# EAGLE design project_simonsays (EAGLE 9.6.2)
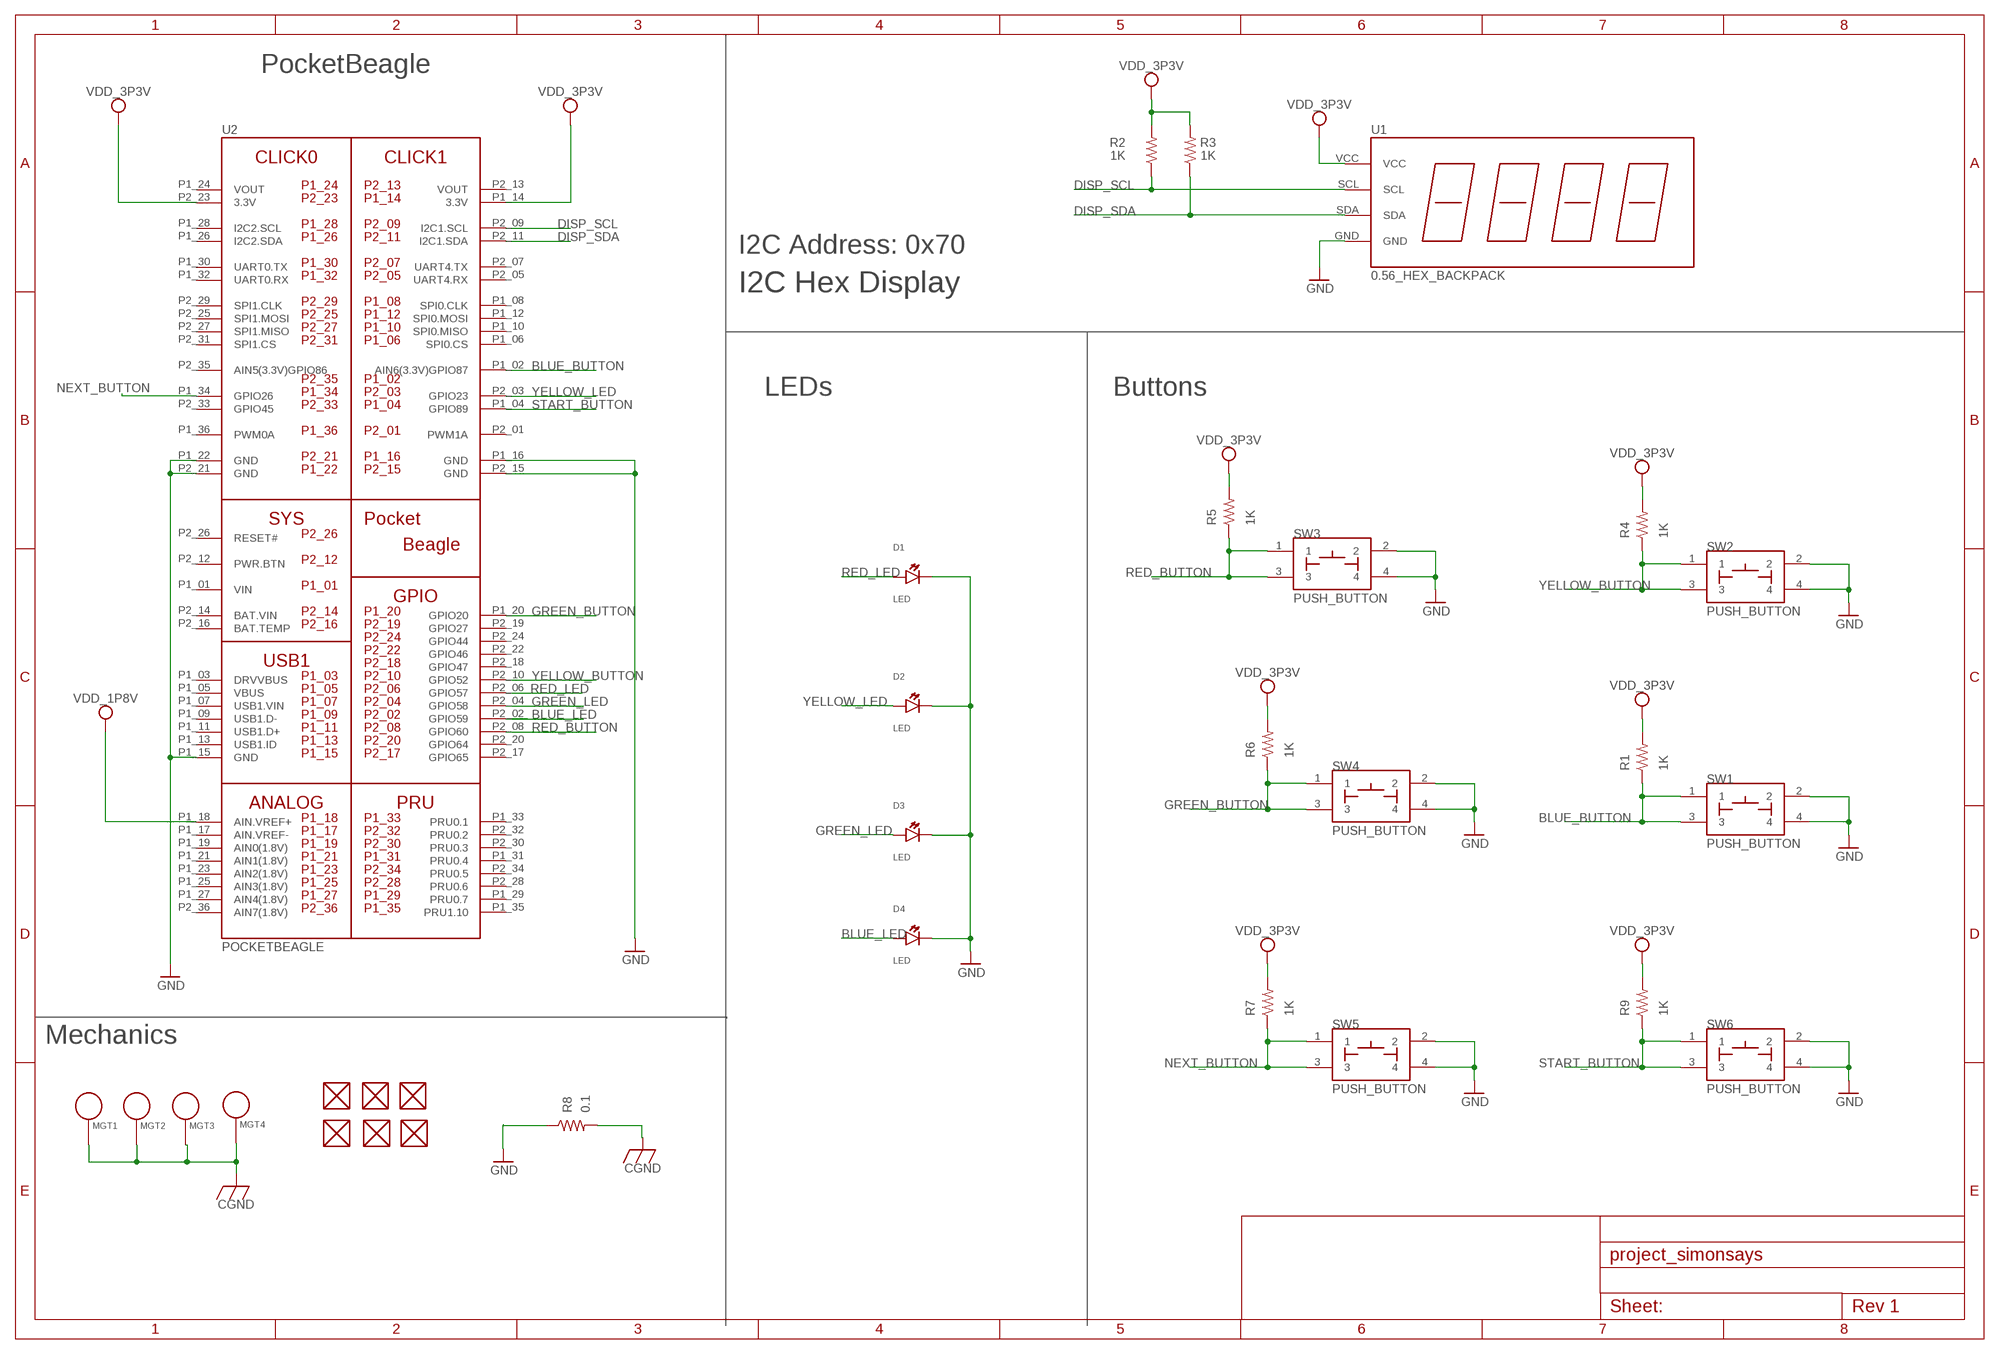
[diagram p0: schematic, sheet 1]

## Parts
D1  LED  [EIA-STD]
D2  LED  [EIA-STD]
D3  LED  [EIA-STD]
D4  LED  [EIA-STD]
FUD1  FIDUCIAL  [FIDUCIAL_40MIL]
FUD2  FIDUCIAL  [FIDUCIAL_40MIL]
FUD3  FIDUCIAL  [FIDUCIAL_40MIL]
FUD4  FIDUCIAL  [FIDUCIAL_40MIL]
FUD5  FIDUCIAL  [FIDUCIAL_40MIL]
FUD6  FIDUCIAL  [FIDUCIAL_40MIL]
MGT1  MOUNTING_HOLE  [MOUNTING_HOLE]
MGT2  MOUNTING_HOLE  [MOUNTING_HOLE]
MGT3  MOUNTING_HOLE  [MOUNTING_HOLE]
MGT4  MOUNTING_HOLE  [MOUNTING_HOLE]
R1  1K  R_R0603  [R0603]
R2  1K  R_R0603  [R0603]
R3  1K  R_R0603  [R0603]
R4  1K  R_R0603  [R0603]
R5  1K  R_R0603  [R0603]
R6  1K  R_R0603  [R0603]
R7  1K  R_R0603  [R0603]
R8  0.1  R_R0805  [R0805]
R9  1K  R_R0603  [R0603]
SW1  PUSH_BUTTON  [BUTTON_12.5MM]
SW2  PUSH_BUTTON  [BUTTON_12.5MM]
SW3  PUSH_BUTTON  [BUTTON_12.5MM]
SW4  PUSH_BUTTON  [BUTTON_12.5MM]
SW5  PUSH_BUTTON  [BUTTON_12.5MM]
SW6  PUSH_BUTTON  [BUTTON_12.5MM]
U1  0.56_HEX_BACKPACK  [0.56_HEX_BACKPACK]
U2  POCKETBEAGLE  [POCKETBEAGLE]

## Nets
BLUE_BUTTON: R1.1 SW1.1 SW1.3 U2.P1_02(AIN6(3.3V)GPIO87)
BLUE_LED: D4.ANODE U2.P2_02(GPIO59)
CGND: MGT1.P$1 MGT2.P$1 MGT3.P$1 MGT4.P$1 R8.2
DISP_SCL: R2.1 U1.SCL U2.P2_09(I2C1.SCL)
DISP_SDA: R3.1 U1.SDA U2.P2_11(I2C1.SDA)
GND: D1.CATHODE D2.CATHODE D3.CATHODE D4.CATHODE R8.1 SW1.2 SW1.4 SW2.2 SW2.4 SW3.2 SW3.4 SW4.2 SW4.4 SW5.2 SW5.4 SW6.2 SW6.4 U1.GND U2.P1_15(GND) U2.P1_16(GND) U2.P1_22(GND) U2.P2_15(GND) U2.P2_21(GND)
GREEN_BUTTON: R6.1 SW4.1 SW4.3 U2.P1_20(GPIO20)
GREEN_LED: D3.ANODE U2.P2_04(GPIO58)
NEXT_BUTTON: R7.1 SW5.1 SW5.3 U2.P1_34(GPIO26)
RED_BUTTON: R5.1 SW3.1 SW3.3 U2.P2_08(GPIO60)
RED_LED: D1.ANODE U2.P2_06(GPIO57)
START_BUTTON: R9.1 SW6.1 SW6.3 U2.P1_04(GPIO89)
VDD_1P8V: U2.P1_18(AIN.VREF+)
VDD_3P3V: R1.2 R2.2 R3.2 R4.2 R5.2 R6.2 R7.2 R9.2 U1.VCC U2.P1_14(3.3V) U2.P2_23(3.3V)
YELLOW_BUTTON: R4.1 SW2.1 SW2.3 U2.P2_10(GPIO52)
YELLOW_LED: D2.ANODE U2.P2_03(GPIO23)
Unconnected: FUD1.P$1 FUD2.P$1 FUD3.P$1 FUD4.P$1 FUD5.P$1 FUD6.P$1 U2.P1_03(DRVVBUS) U2.P1_05(VBUS) U2.P1_06(SPI0.CS) U2.P1_07(USB1.VIN) U2.P1_08(SPI0.CLK) U2.P1_09(USB1.D-) U2.P1_10(SPI0.MISO) U2.P1_11(USB1.D+) U2.P1_12(SPI0.MOSI) U2.P1_13(USB1.ID) U2.P1_17(AIN.VREF-) U2.P1_19(AIN0(1.8V)) U2.P1_21(AIN1(1.8V)) U2.P1_23(AIN2(1.8V)) U2.P1_25(AIN3(1.8V)) U2.P1_26(I2C2.SDA) U2.P1_27(AIN4(1.8V)) U2.P1_28(I2C2.SCL) U2.P1_29(PRU0.7) U2.P1_30(UART0.TX) U2.P1_31(PRU0.4) U2.P1_32(UART0.RX) U2.P1_33(PRU0.1) U2.P1_35(PRU1.10) U2.P1_36(PWM0A) U2.P2_01(PWM1A) U2.P2_05(UART4.RX) U2.P2_07(UART4.TX) U2.P2_12(PWR.BTN) U2.P2_16(BAT.TEMP) U2.P2_17(GPIO65) U2.P2_18(GPIO47) U2.P2_19(GPIO27) U2.P2_20(GPIO64) U2.P2_22(GPIO46) U2.P2_24(GPIO44) U2.P2_25(SPI1.MOSI) U2.P2_26(RESET#) U2.P2_27(SPI1.MISO) U2.P2_28(PRU0.6) U2.P2_29(SPI1.CLK) U2.P2_30(PRU0.3) U2.P2_31(SPI1.CS) U2.P2_32(PRU0.2) U2.P2_33(GPIO45) U2.P2_34(PRU0.5) U2.P2_35(AIN5(3.3V)GPIO86) U2.P2_36(AIN7(1.8V))

## Notes on the sheet
- PocketBeagle
- I2C Address: 0x70
- I2C Hex Display
- LEDs | Buttons
- Mechanics

## Power pins joined to a net without a drawn wire
BAT.VIN: U2.P2_14(BAT.VIN)
VIN: U2.P1_01(VIN)
VOUT: U2.P1_24(VOUT) U2.P2_13(VOUT)

## Library data of the parts
D1-D4 = project_simonsays:LED: EIA-STD LED, LTST-C191TBKT
FUD1-FUD6 = combo_lock:FIDUCIAL
MGT1-MGT4 = combo_lock:MOUNTING_HOLE: Chassis Mounting Hole w/GND connection ability
R1-R7 R9 = project_simonsays:R_: RESISTOR, American symbol
R8 = combo_lock:R_: RESISTOR, American symbol
SW1-SW6 = project_simonsays:PUSH_BUTTON
U1 = project_simonsays:0.56_HEX_BACKPACK: 0.56" LED HEX Backback - Adafruit HT16K33 - https://www.adafruit.com/product/878 - https://www.adafruit.com/product/879 - https://www.adafruit.com/product/880 - https://www.adafruit.com/product/881 - https://www.adafruit.com/product/1002
U2 = project_simonsays:POCKETBEAGLE

## Board
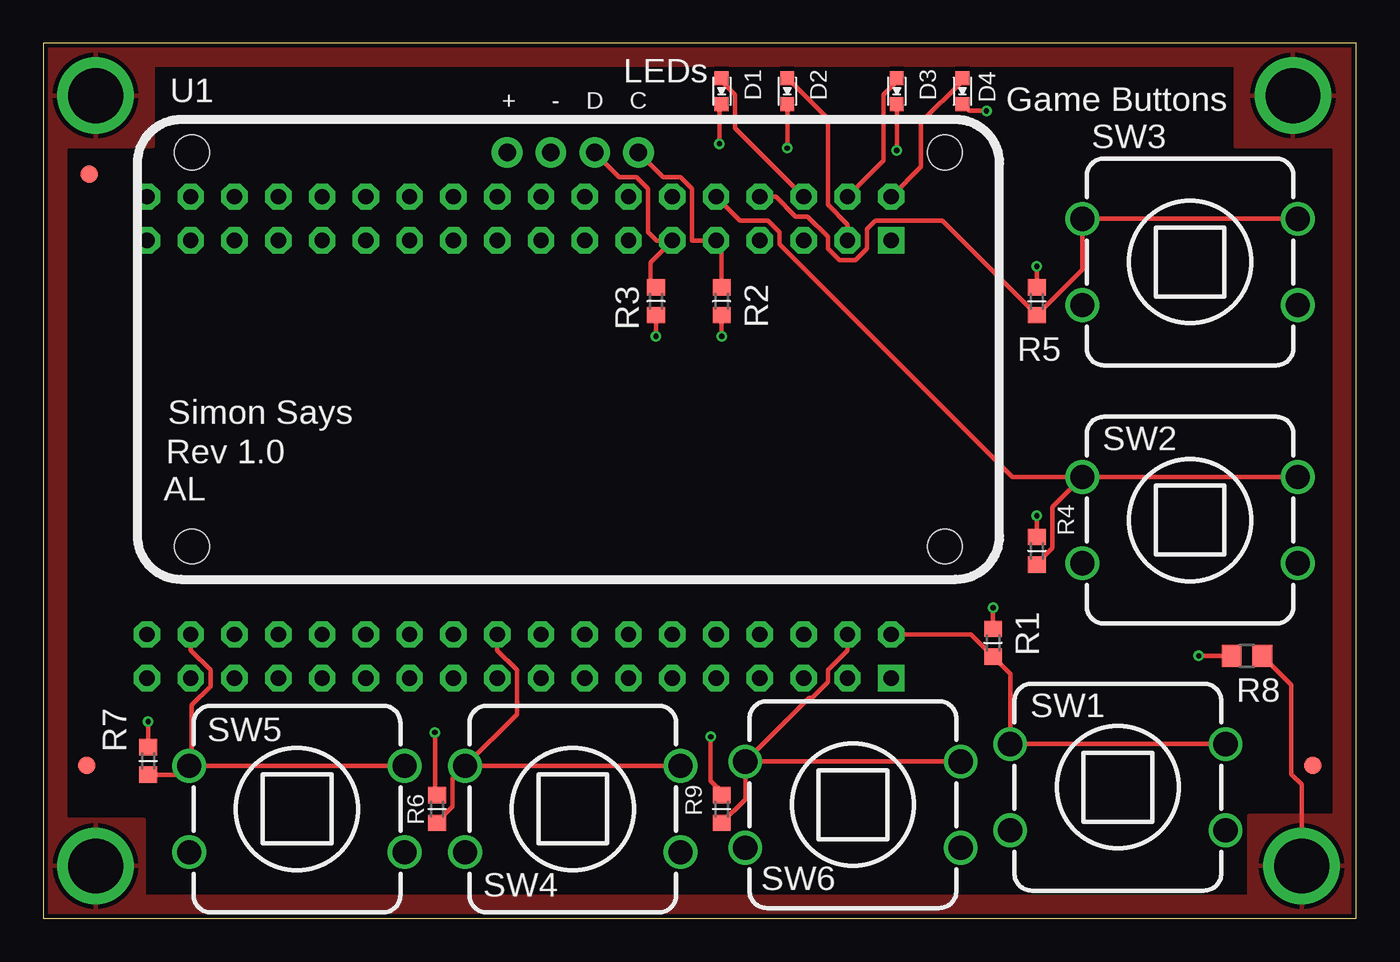
[diagram p1: board, top side]
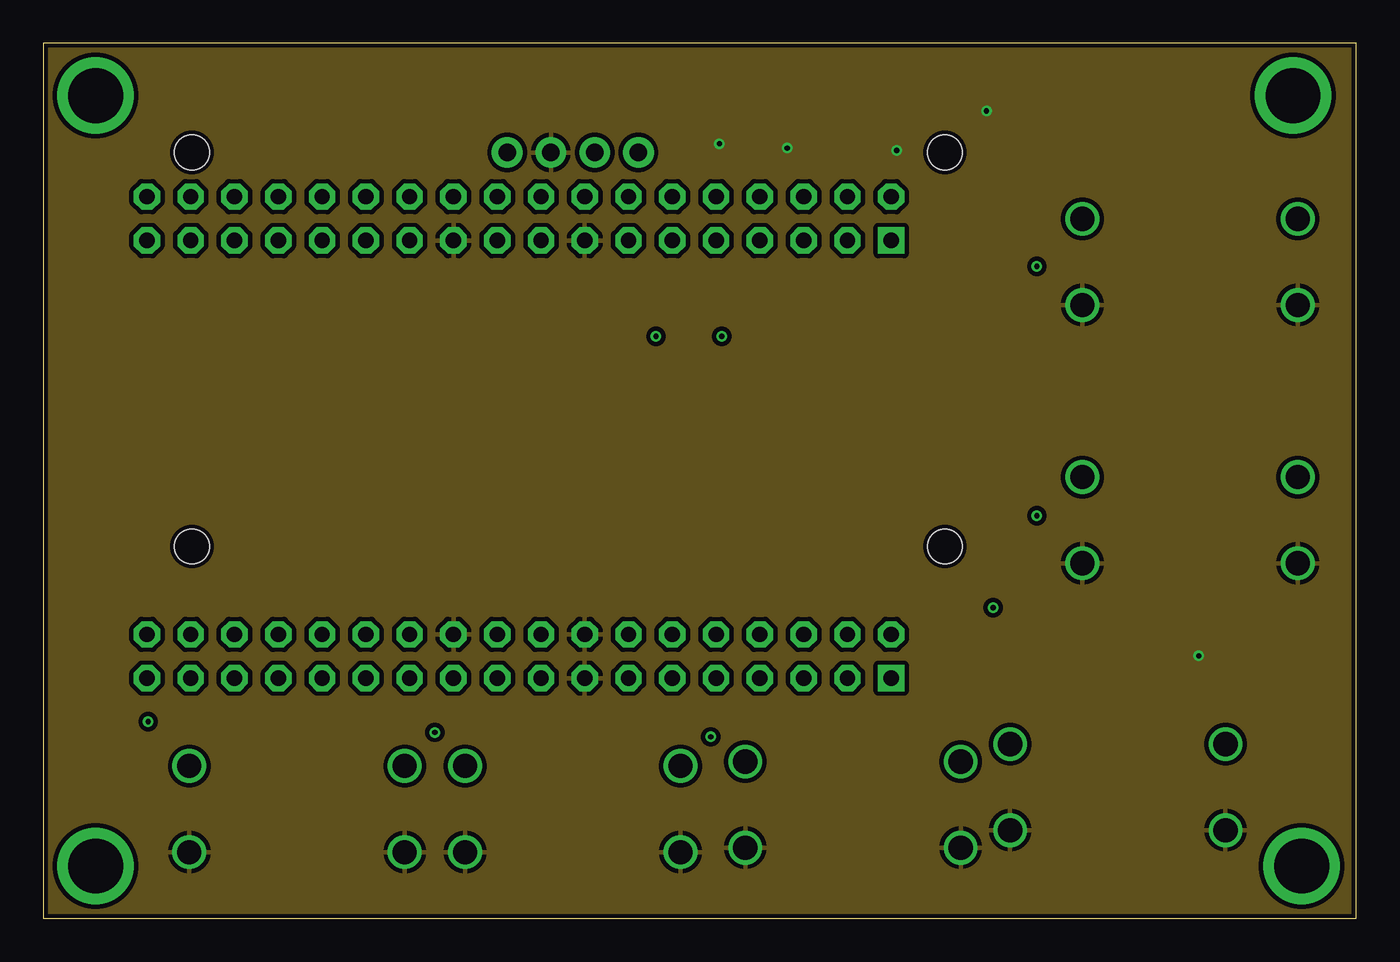
[diagram p2: board, inner layer Route2]
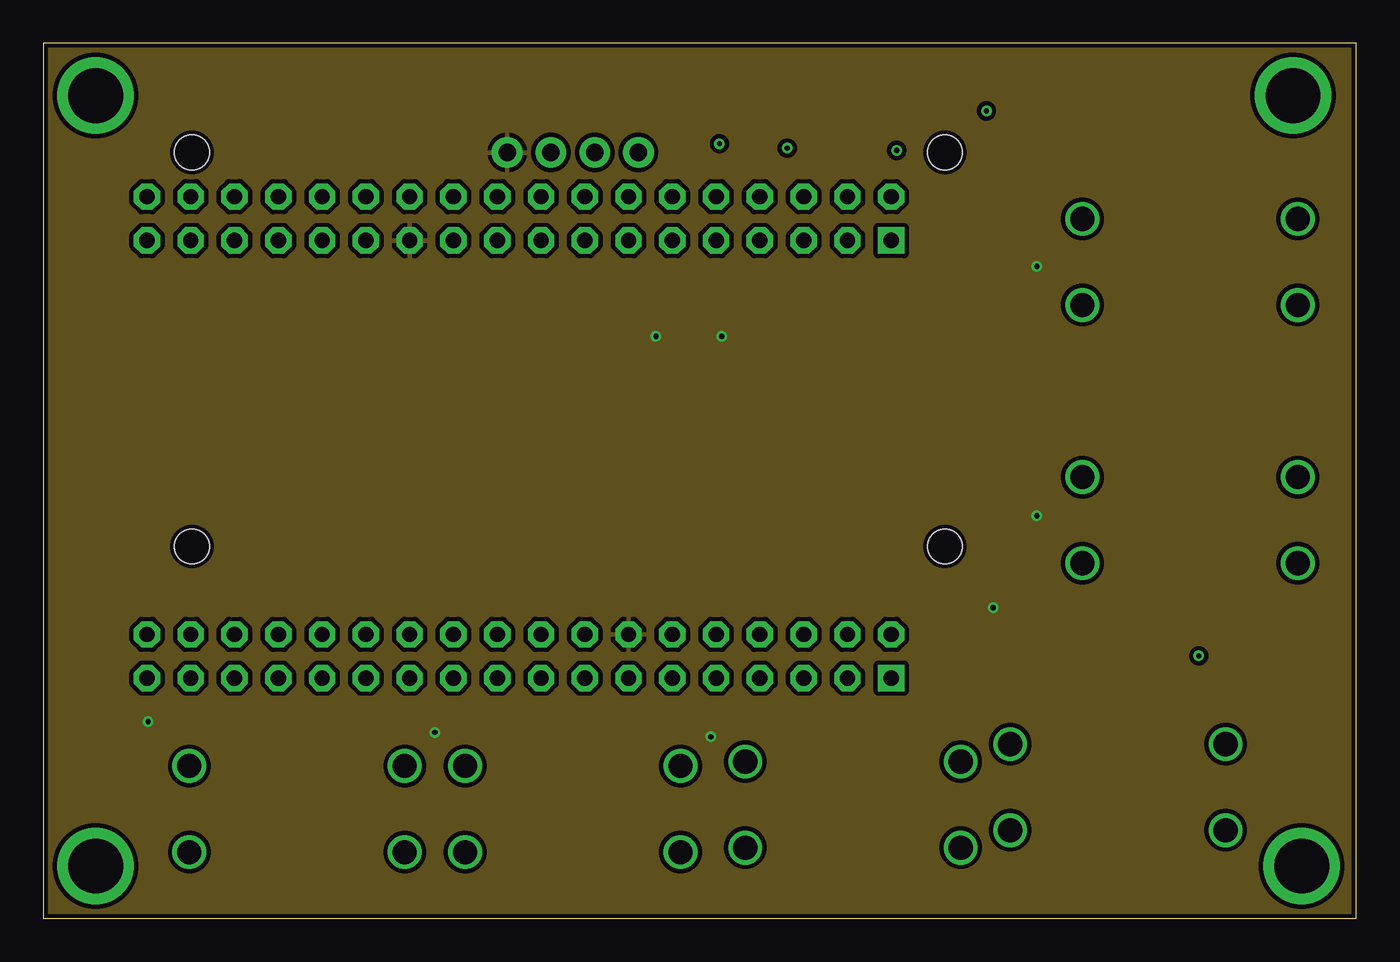
[diagram p3: board, inner layer Route15]
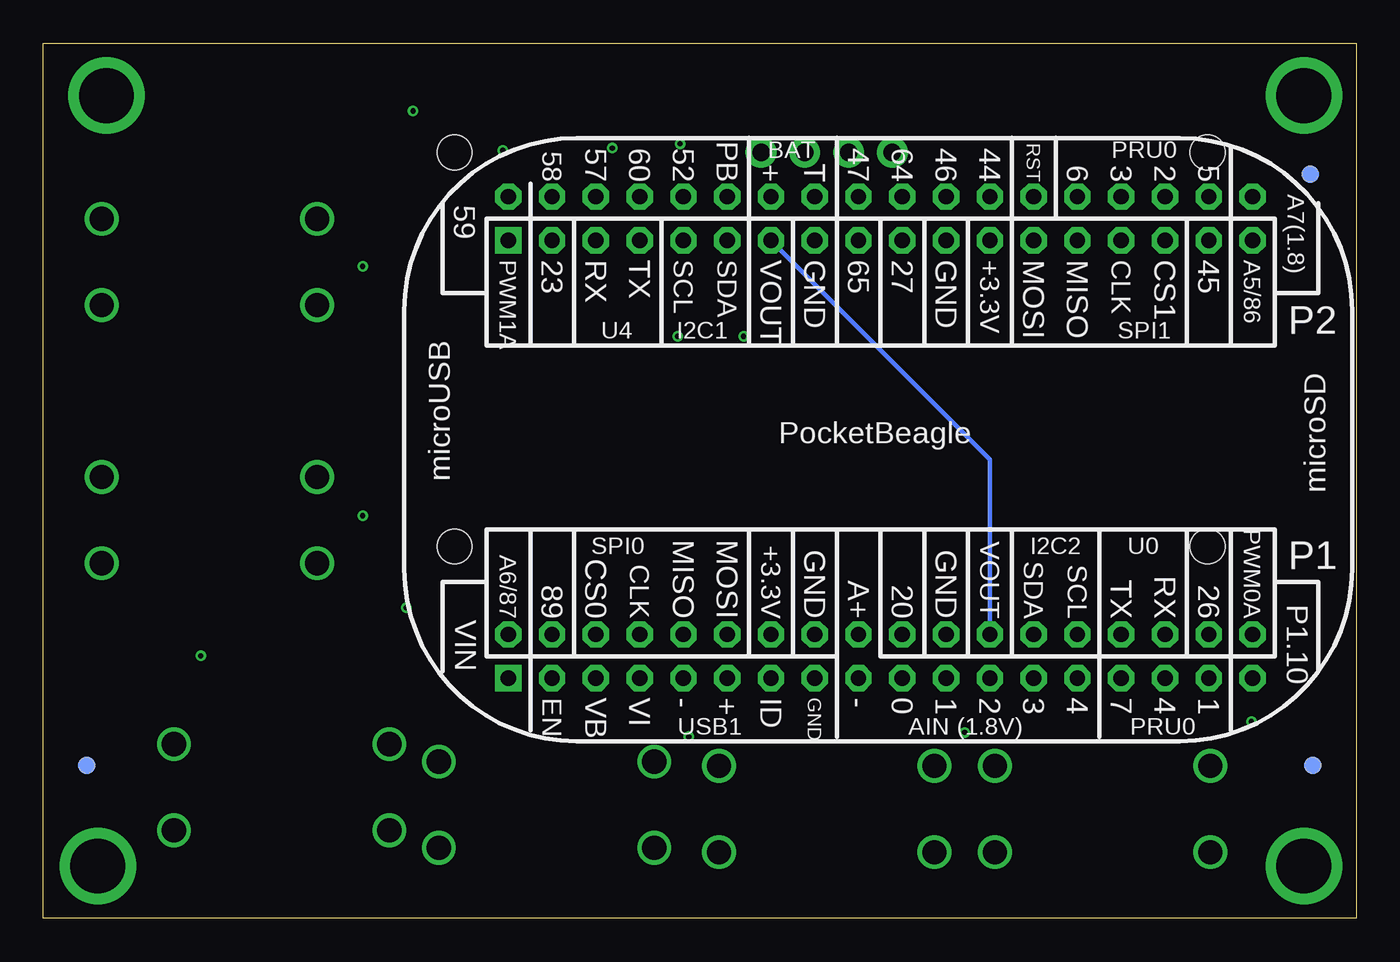
[diagram p4: board, bottom side, seen from below]

Size 76.2 x 50.8 mm. Coordinates in mm from the lower left corner, seen from the top.
Outline: 0,0 76.2,0 76.2,50.8 0,50.8 0,0
Copper layers (1*2*15*16): Top 0.035mm / dielectric 0.23mm / Route2 0.035mm / dielectric 0.93mm / Route15 0.035mm / dielectric 0.23mm / Bottom 0.035mm
Design rules "ENGI301_4lyr": minimum track width 10mil, minimum drill 12mil, track to track 10mil, track to pad 10mil, pad to pad 10mil, via to via 10mil, smd to smd 10mil, copper to edge 10mil, drill to drill 12mil, minimum pad ring 6mil, minimum via ring 6mil, stop-mask expansion 3mil, vias tented up to drill 25mil, thermal gap 10mil

### Footprints (pad centres in the part's own frame; a part is rotated, then mirrored left to right if it is on the bottom)
EIA-STD = smd 0.8 x 0.8: ANODE -0.75,0; CATHODE 0.75,0
FIDUCIAL_40MIL = smd 1.016 x 1.016: P$1 0,0
MOUNTING_HOLE = drill 3.175 pad 4.445: P$1 0,0
R0603 = smd 0.95 x 1.031: 1 -0.8,0; 2 0.8,0
R0805 = smd 1.143 x 1.27: 1 -0.889,0; 2 0.889,0
BUTTON_12.5MM = drill 1.4: 1 -6.25,2.5; 2 -6.25,-2.5; 3 6.25,2.5; 4 6.25,-2.5
0.56_HEX_BACKPACK = drill 1.016 pad 1.778: GND -1.016,11.43; SCL 4.064,11.43; SDA 1.524,11.43; VCC -3.556,11.43 | hole 2: -21.844,-11.43; 21.844,-11.43; -21.844,11.43; 21.844,11.43
POCKETBEAGLE = drill 0.889 pad 1.524 square: P1_01 5.91,3.53; P2_01 5.91,28.93 | drill 0.889 pad 1.524 octagon: P1_02 5.91,6.07; P1_03 8.45,3.53; P1_04 8.45,6.07; P1_05 10.99,3.53; P1_06 10.99,6.07; P1_07 13.53,3.53; P1_08 13.53,6.07; P1_09 16.07,3.53; P1_10 16.07,6.07; P1_11 18.61,3.53; P1_12 18.61,6.07; P1_13 21.15,3.53; P1_14 21.15,6.07; P1_15 23.69,3.53; P1_16 23.69,6.07; P1_17 26.23,3.53; P1_18 26.23,6.07; P1_19 28.77,3.53; P1_20 28.77,6.07; P1_21 31.31,3.53; P1_22 31.31,6.07; P1_23 33.85,3.53; P1_24 33.85,6.07; P1_25 36.39,3.53; P1_26 36.39,6.07; P1_27 38.93,3.53; P1_28 38.93,6.07; P1_29 41.47,3.53; P1_30 41.47,6.07; P1_31 44.01,3.53; P1_32 44.01,6.07; P1_33 46.55,3.53; P1_34 46.55,6.07; P1_35 49.09,3.53; P1_36 49.09,6.07; P2_02 5.91,31.47; P2_03 8.45,28.93; P2_04 8.45,31.47; P2_05 10.99,28.93; P2_06 10.99,31.47; P2_07 13.53,28.93; P2_08 13.53,31.47; P2_09 16.07,28.93; P2_10 16.07,31.47; P2_11 18.61,28.93; P2_12 18.61,31.47; P2_13 21.15,28.93; P2_14 21.15,31.47; P2_15 23.69,28.93; P2_16 23.69,31.47; P2_17 26.23,28.93; P2_18 26.23,31.47; P2_19 28.77,28.93; P2_20 28.77,31.47; P2_21 31.31,28.93; P2_22 31.31,31.47; P2_23 33.85,28.93; P2_24 33.85,31.47; P2_25 36.39,28.93; P2_26 36.39,31.47; P2_27 38.93,28.93; P2_28 38.93,31.47; P2_29 41.47,28.93; P2_30 41.47,31.47; P2_31 44.01,28.93; P2_32 44.01,31.47; P2_33 46.55,28.93; P2_34 46.55,31.47; P2_35 49.09,28.93; P2_36 49.09,31.47

### Placement (x,y rotation side)
D1  39.37,48.01 270 top
D2  43.18,48.01 270 top
D3  49.53,48.01 270 top
D4  53.34,48.01 270 top
FUD1  2.67,43.18 0 bottom
FUD2  2.54,8.89 0 bottom
FUD3  73.66,8.89 0 bottom
FUD4  73.66,8.89 0 top
FUD5  2.67,43.18 0 top
FUD6  2.54,8.89 90 top
MGT1  3.05,47.75 0 top
MGT2  72.52,47.75 0 top
MGT3  73.03,3.05 0 top
MGT4  3.05,3.05 0 top
R1  55.12,16 90 top
R2  39.37,35.81 270 top
R3  35.56,35.81 270 top
R4  57.66,21.34 90 top
R5  57.66,35.81 90 top
R6  22.86,6.35 90 top
R7  6.1,9.14 90 top
R8  69.85,15.24 0 top
R9  39.37,6.35 90 top
SW1  62.36,7.62 0 top
SW2  66.55,23.11 0 top
SW3  66.55,38.1 0 top
SW4  30.73,6.35 0 top
SW5  14.73,6.35 0 top
SW6  46.99,6.6 0 top
U1  30.48,33.02 0 top
U2  55.12,10.41 0 bottom

### Tracks (layer width: path | path; a pad name or v marks a point on that pad's centre or on a via)
BLUE_BUTTON
  Top 0.254: SW1.1 56.13,10.12 | 56.13,10.12 SW1.3 | 56.13,10.12 56.13,14.19 R1.1 53.84,16.48 U2.P1_02
BLUE_LED
  Top 0.254: U2.P2_02 50.94,43.62 50.94,46.2 53.34,48.59 D4.ANODE
CGND
  Top 0.254: MGT3.P$1 73.03,7.78 72.42,8.38 72.42,13.56 R8.2
  pour Top: -1.27,25.4 -1.27,-1.27 77.47,-1.27 77.47,25.4 74.93,25.4 74.93,5.97 69.98,5.97 69.98,1.27 5.84,1.27 5.84,5.71 1.27,5.71 1.27,25.4
  pour Top: -1.27,25.4 -1.27,52.07 77.47,52.07 77.47,25.4 74.93,25.4 74.93,44.83 69.22,44.83 69.22,49.53 6.35,49.53 6.35,44.83 1.27,44.83 1.27,25.4
DISP_SCL
  Top 0.254: R2.1 39.37,39.02 U2.P2_09 37.65,39.34 37.65,42.36 36.98,43.03 35.97,43.03 U1.SCL
DISP_SDA
  Top 0.254: R3.1 35.24,36.94 35.24,38.07 U2.P2_11 35.59,39.34 35.11,39.82 35.11,42.36 34.44,43.03 33.43,43.03 U1.SDA
GND  (via drill 0.3 pad 0.61)
  Top 0.254: D4.CATHODE 53.73,46.86 v54.74,46.86 | D3.CATHODE v49.53,44.58 | D2.CATHODE v43.18,44.7 | D1.CATHODE 39.24,47.13 v39.24,44.96 | R8.1 v67.06,15.24
  pour Route2: -2.54,-2.54 -2.54,53.34 78.74,53.34 78.74,-2.54
GREEN_BUTTON
  Top 0.254: R6.1 22.86,5.62 23.76,6.52 23.76,8.12 24.33,8.69 SW4.1 | SW4.1 SW4.3 | U2.P1_20 26.35,15.56 27.49,14.42 27.49,11.86 SW4.1
GREEN_LED
  Top 0.254: D3.ANODE 49.53,48.59 48.75,47.81 48.75,43.97 U2.P2_04
NEXT_BUTTON
  Top 0.254: R7.1 7.98,8.34 SW5.1 8.64,8.85 | 8.64,8.85 SW5.3 | U2.P1_34 8.57,15.56 9.71,14.42 9.71,13.47 8.64,12.4 8.64,8.85
RED_BUTTON
  Top 0.254: SW3.3 SW3.1 60.3,37.65 R5.1 52.19,40.49 48.29,40.49 47.81,40.01 47.81,38.87 47.14,38.2 46.2,38.2 45.52,38.87 45.52,39.56 44.35,40.74 43.66,40.74 42.51,41.88 U2.P2_08
RED_LED
  Top 0.254: D1.ANODE 39.37,48.59 40.15,47.81 40.15,45.86 U2.P2_06
START_BUTTON
  Top 0.254: R9.1 40.74,6.92 SW6.1 | SW6.1 SW6.3 | SW6.1 44.44,12.8 44.6,12.8 45.52,13.72 45.52,14.42 46.67,15.56 U2.P1_04
VDD_3P3V  (via drill 0.3 pad 0.61)
  Top 0.254: R2.2 v39.37,33.78 | R3.2 v35.56,33.78 | v6.1,11.43 R7.2 | v22.73,10.79 22.73,7.28 R6.2 | R9.2 39.37,7.37 38.73,8 v38.73,10.54 | R1.2 v55.12,18.03 | R4.2 v57.66,23.37 | R5.2 v57.66,37.85
  pour Route15: -5.08,-5.08 -5.08,55.88 81.28,55.88 81.28,-5.08
VOUT
  Bottom 0.254: U2.P1_24 21.27,26.64 U2.P2_13
YELLOW_BUTTON
  Top 0.254: R4.1 57.66,20.61 58.55,21.5 58.55,23.87 SW2.1 | SW2.1 60.71,25.61 SW2.3 | U2.P2_10 40.45,40.49 42.06,40.49 42.73,39.82 42.73,39.12 56.24,25.61 SW2.1
YELLOW_LED
  Top 0.254: U2.P2_03 46.67,40.27 45.52,41.41 45.52,46.41 D2.ANODE

### Text on the board
tPlace: LEDs | Game Buttons | Simon Says | Rev 1.0 | AL